# Altium schematic sheet Eload Gen 3 Power Module - Input.SchDoc
size B
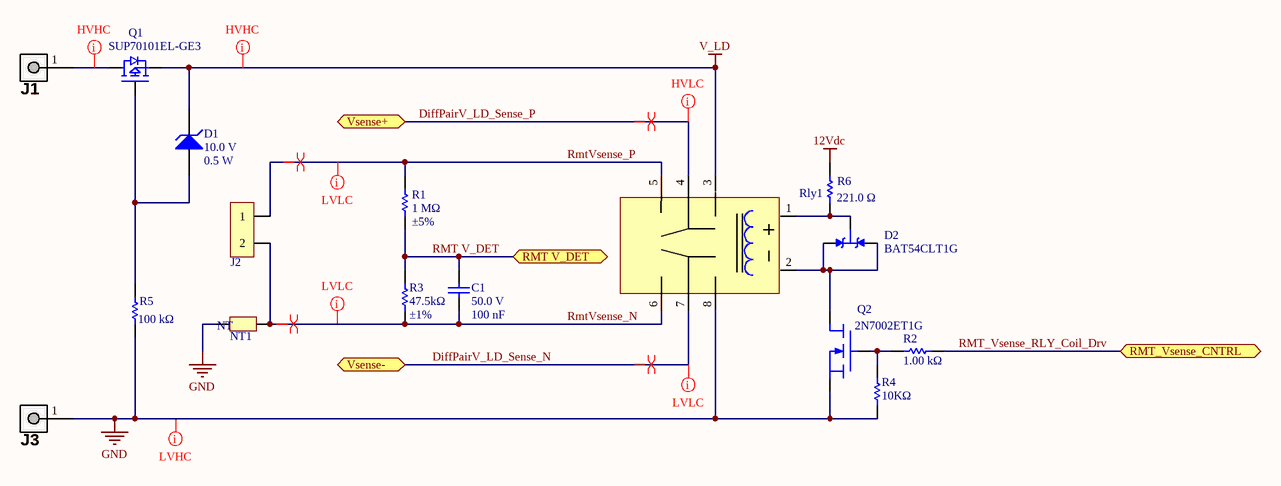
[diagram p0: Eload Gen 3 Power Module - Input.SchDoc]

## Parts
C1  Voltage Rating (DC): 50.0 V  Capacitance: 100 nF  [Cap,0805]  (hidden comment: 08055C104JAT2A)
D1  Breakdown Voltage: 10.0 V  Power Rating: 0.5 W  [SOD123]  (hidden comment: MMSZ5240BT1G)
D2  BAT54CLT1G  [SOT23-3]
J1  wire teminal, lugs, screw, Keystone 8197  [Keystone 8197]  (value not drawn)
J2  TE Connectivity 282836-2  [TERM BLOCK 2POS SIDE ENTRY 5MM]  (value not drawn)
J3  wire teminal, lugs, screw, Keystone 8197  [Keystone 8197]  (value not drawn)
NT1  Net Tie,0.254mm  [0.254mm Net Tie]  (value not drawn)  (net tie, no BOM)
Q1  SUP70101EL-GE3  [TO-220 RA]
Q2  2N7002ET1G  [SOT23-3]
R1  Tolerance: ±5%  Resistance: 1 MΩ  [res, 0805, HD]  (hidden comment: CR0805-JW-105ELF)
R2  Resistance: 1.00 kΩ  [res, 0805, HD]  (hidden comment: Vishay CRCW08051K00JNEA)
R3  Resistance: 47.5kΩ  Tolerance: ±1%  [res, 0805, HD]  (hidden comment: RK73H2ATTD4752F)
R4  Resistance: 10KΩ  [res, 0805, HD]  (hidden comment: Vishay / Dale CRCW080510K0FKTA)
R5  Resistance: 100 kΩ  [res, 0805, HD]  (hidden comment: CRCW0805100KFKEA)
R6  Resistance: 221.0 Ω  [res, 0805, HD]  (hidden comment: Vishay Dale CRCW0805221RFKTA)
Rly1  EE2-5NU  [Relay,SMD,Gull Wing,DPDT (2 Form C),EE2-5NU]  (value not drawn)

## Ports
RMT V_DET, RMT_Vsense_CNTRL, Vsense+, Vsense-

## Nets
12Vdc: R6.2
GND: J3.1 NT1.1 Q2.2(S) R4.1 R5.1 Rly1.8
V_LD: D1.1(K) Q1.3(Source) Rly1.3
DiffPairV_LD_Sense_N: Rly1.7 ; port Vsense-
DiffPairV_LD_Sense_P: Rly1.4 ; port Vsense+
RMT V_DET: C1.2 R1.1 R3.2 ; port RMT V_DET
RMT_Vsense_RLY_Coil_Drv: R2.2 ; port RMT_Vsense_CNTRL
RmtVsense_N: C1.1 J2.2 NT1.2 R3.1 Rly1.6
RmtVsense_P: J2.1 R1.2 Rly1.5
NetD1_2: D1.2(A) Q1.1(Gate) R5.2
NetD2_1: D2.1(A1) D2.2(A2) Q2.3(D) Rly1.2(C-)
NetD2_3: D2.3(C) R6.1 Rly1.1(C+)
NetJ1_1: J1.1 Q1.2(Drain)
NetQ2_1: Q2.1(G) R2.1 R4.2

## Layout directives
differential pair: DiffPairV_LD_Sense_N, DiffPairV_LD_Sense_P, RmtVsense_N, RmtVsense_P
net class Low Volt; net class Low Current; net class PwrRail: DiffPairV_LD_Sense_N, RmtVsense_N, RmtVsense_P
net class High Volt; net class Low Current: DiffPairV_LD_Sense_P
net class High Volt; net class High Current: NetJ1_1, V_LD
net class Low Volt; net class High Current: GND

## Notes on the sheet
- (in symbol Net Tie,0.254mm) NT

## Library data of the parts
C1 = Cap,0805,100nf,50V,5%,08055C104JAT2A: Capacitor; Ceramic; Cap 0.1 uF; Tol 5%; Vol-Rtg 50 VDC; SMT; 0805; X7R; Tape & Reel; Lead-Free Status: Lead Free; Case/Package (SI): 2012; Insulation Resistance: 100 GΩ; Detailed Description: 0.1µF ±5% 50V Ceramic Capacitor X7R 0805 (2012 Metric); Mounting Style: Surface Mount; Packaging: Tape & Reel (TR), Cut Tape (CT); RoHS: Compliant; Size-Width: 1.24 mm; Case/Package: 0805; Number of Pins: 2; digikey url: http://www.digikey.ca/product-detail/en/avx-corporation/08055C104JAT2A/478-3352-1-ND/930144; REACH SVHC Compliance: No SVHC; Dielectric Characteristic: X7R; Capacitance Tolerance: ±5%; Size-Length: 2.01 mm; Size-Height: 710 µm; Size-Thickness: 940 µm; Manufacturer Part Number: 08055C104JAT2A; Octopart URL: http://octopart.com/08055c104jat2a-avx-55388010; Operating Temperature: -55°C ~ 125°C; Supplier 1: Digi-Key; Supplier Part Number 1: 478-3352-1-ND
D1 = Diode, Zener,SOD-123,10V,500mW, MMSZ5240BT1G: Zener Voltage Regulator, 500 mW, 2-Pin SOD-123, Pb-Free, Tape and Reel; Lead-Free Status: Lead Free; Material: Plastic; Case/Package: SOD-123; Lifecycle Status: Active; Mounting Style: Surface Mount; Number of Pins: 2; REACH SVHC Compliance: No SVHC; RoHS: Compliant; Voltage Rating (DC): 10.0 V; Supplier 1: Digi-Key; Supplier Part Number 1: MMSZ5240BT1GOSCT-ND; Supplier 2: LCSC; Supplier Part Number 2: C82084
D2 = Diode, SOT-23-3,600ma,30V,Dual Common Cathode, BAT54CLT1G: BAT54CLT1G Series 30V 600 mA Dual Common Cathode Schottky Barrier Diode-SOT-23-3; Lead-Free Status: Lead Free; Current Rating: 200 mA; Voltage Rating (DC): 30.0 V; Capacitance: 10.0 pF; Lifecycle Status: Active; RoHS: Compliant; Halogen Free Status: Halogen Free; Number of Pins: 3; Mounting Style: Surface Mount; Case/Package: SOT-23; Packaging: Tape & Reel (TR), Cut Tape (CT); REACH SVHC Compliance: No SVHC; Supplier 1: Digi-Key; Supplier Part Number 1: BAT54CLT1GOSCT-ND; Supplier 2: LCSC; Supplier Part Number 2: C14308; mfg P/N: BAT54CLT1G
J1 J3 = wire teminal, lugs, screw, Keystone 8197: WRIGHT TOOL 8197 Socket, 1 In Dr, 3-1/8 In, 12 Pt, Std. More details: Socket, Drive Size 1 In., Number of Points 12, ...; Manufacturer Part Number: 8197; Current Rating: 30.0 A; Pin Pitch: 0.0020066 m; Lead-Free Status: Lead Free; Number of Contacts: 6; Gender: Male; REACH SVHC Compliance: No SVHC; Orientation: Straight; Contact Material: Brass; Size-Height: 0.011684 m; Contact Plating: Tin; Number of Rows: 2; RoHS: Compliant; Mounting Style: Snap-In, PCB; Termination Style: Screw; Supplier 1: Digi-Key; Supplier Part Number 1: 36-8197-ND; Supplier 2: Digi-Key; Supplier Part Number 2: 36-8197-2-ND; Supplier 3: Digi-Key; Supplier Part Number 3: 36-8197-3-ND; Supplier 4: LCSC; Supplier Part Number 4: C238177
J2 = TERM BLOCK 2POS SIDE ENTRY 5MM, 282836-2: Wire to Board 2 Position 5 mm Pitch 30-16 AWG Euro Style Terminal Block; Voltage Rating (AC): 250.0 V; ELV Compliant: Compliant; Current Rating: 13.5 A; Number of Contacts: 2; Pin Pitch: 0.005 m; Lead-Free Status: Lead Free; Wire Gauge: 15.0 AWG; RoHS: Compliant; Contact Material: Brass; Contact Plating: Tin; Color: Green; Manufacturer Part Number: 282836-2; Flammability Rating: UL 94 V-0; Mounting Style: PCB; Housing Material: Nylon 6/6; Insulation Material: Nylon; Housing Color: Green; Orientation: Right Angle; Lifecycle Status: Active; REACH SVHC Compliance: No SVHC; Number of Positions: 2; Supplier 1: TME; Supplier 2: Newark; Supplier 3: Digi-Key; Supplier 4: Digi-Key; Supplier Part Number 4: A98076-ND
Q1 = MOSFET,P-Chan,100V,120A,TO220, SUP70101EL-GE3: MOSFET P-CH 100V 120A TO220AB; Manufacturer: Vishay Siliconix; mfg P/N: SQM50P08-25L_GE3; Detailed Description: P-Channel 100V 120A (Tc) 375W (Tc) Through Hole TO-220AB; Categories: Discrete Semiconductor Products; Current - Continuous Drain (Id) @ 25°C: 120A (Tc); Drive Voltage (Max Rds On, Min Rds On): 4.5V, 10V; Rds On (Max) @ Id, Vgs: 10mOhm; Gate Charge (Qg) (Max) @ Vgs: 190nC @ 10V; Vgs (Max): ±20V; Input Capacitance: 7000pF @ 50V; Power Dissipation (Max): 375W (Tc); Vgs(th) (Max) @ Id: 2.5V @ 250µA; FET Type: P-Channel; Series: Automotive, AEC-Q101, TrenchFET®; Part Status: Active; Technology: MOSFET (Metal Oxide); Drain to Source Voltage (Vdss): 100V; Operating Temperature: -55°C ~ 175°C (TJ); Mounting Type: Through Hole; Supplier Device Package: TO-220AB; Package / Case: TO-220-3; Supplier 1: Digi-Key; Supplier Part Number 1: SUP70101EL-GE3-ND
Q2 = MOSFET,N-Channel,SOT23,0.25A,60V,2N7002ET1G: Small Signal MOSFET, 60 V, 310 mA, Single, N-Channel, 3-Pin SOT-23, Pb-Free, Tape and Reel; Manufacturer: ON Semiconductor; Continuous Drain Current (Ids): 0.25A; Lead-Free Status: Lead Free; Drain to Source Voltage (Vds): 60.0 V; Power Dissipation (Max): 350mW (Ta); REACH SVHC Compliance: No SVHC; Number of Pins: 3; Halogen Free Status: Halogen Free; Case/Package: SOT-23-3; Polarity: N-Channel; RoHS: Compliant; Lifecycle Status: Active; Manufacturer Part Number: 2N7002ET1G; Supplier 1: Digi-Key; Supplier Part Number 1: 2N7002ET1GOSCT-ND; Supplier 2: LCSC; Supplier Part Number 2: C71533
R1 = Res,0805,1MegΩ,5%,200ppm,0805W8F1005T5E: RES SMD 1M OHM 5% 1/8W 0805; Manufacturer: Bourns Inc.; Detailed Description: 1 MOhms ±5% 0.125W, 1/8W Chip Resistor 0805 (2012 Metric) Moisture Resistant Thick Film; Power (Watts): 0.125W, 1/8W; Temperature Coefficient: ±200ppm/°C; mfg P/N: CR0805-JW-105ELF; Category: Resistors  Chip Resistor - Surface Mount; Series: CR0805; Part Status: Active; Composition: Thick Film; Features: Moisture Resistant; Operating Temperature: -55°C ~ 155°C; Package / Case: 0805 (2012 Metric); Supplier Device Package: 0805; Size / Dimension: 0.079"" L x 0.049"" W (2.00mm x 1.25mm); Height - Seated (Max): 0.024"" (0.60mm); Supplier 1: Digi-Key; Supplier Part Number 1: CR0805-JW-105ELFCT-ND; JLC ALt LCSC Part #: C26108
R2 = Res,0805,1.00 kΩ,5%,200ppm,CRCW08051K00JNEA: Res Thick Film 0805 1K Ohm 5% 0.125W(1/8W) ±200ppm/C Molded SMD Automotive Paper T/R; Power Rating: 125 mW; Case/Package (SI): 2012; Lead-Free Status: Lead Free; Temperature Coefficient: 200 ppm/°C; Voltage Rating (DC): 150 V; Size-Width: 1.25 mm; Mounting Style: Surface Mount; REACH SVHC Compliance: No SVHC; Manufacturer Part Number: CRCW08051K00JNEA; Number of Pins: 2; Size-Height: 450 µm; Packaging: Tape & Reel (TR), Cut Tape (CT); RoHS: Compliant; Resistance Tolerance: ±5%; Case/Package: 0805; Size-Length: 2.00 mm; Supplier 1: Digi-Key; Supplier Part Number 1: 541-1.0KADKR-ND; Supplier 2: Digi-Key; Supplier Part Number 2: 541-1.0KACT-ND
R3 = Res,0805,47.5KΩ,1%,100ppm,RK73H2ATTD4752F: 47.5 kOhms ±1% 0.25W, 1/4W Chip Resistor 0805 (2012 Metric) Automotive AEC-Q200, Moisture Resistant Thick Film; Manufacturer: KOA Speer Electronics, Inc.; Temperature Coefficient: ±100ppm/°C; Detailed Description: 47.5 kOhms ±1% 0.25W, 1/4W Chip Resistor 0805 (2012 Metric) Automotive AEC-Q200, Moisture Resistant Thick Film; mfg P/N: RK73H2ATTD4752F; Power (Watts): 0.25W, 1/4W; Composition: Thick Film; Features: Automotive AEC-Q200, Moisture Resistant; Operating Temperature: -55°C ~ 155°C; Package / Case 0805: (2012 Metric); Supplier Device Package: 0805; Size / Dimension: 0.079" L x 0.049" W (2.00mm x 1.25mm); Height - Seated (Max): 0.024" (0.60mm); Number of Terminations: 2; Supplier 1: Digi-Key; Supplier Part Number 1: 2019-RK73H2ATTD4752FCT-ND
R4 = Res,0805,10.0kΩ,1%,100 ppm,CRCW080510K0FKTA: RES SMD 10K OHM 1% 1/8W 0805; Temperature Coefficient: 100.0 ppm/C; Lead-Free Status: Contains Lead; Voltage Rating (DC): 150.0 V; Power Rating: 0.125 W; Case/Package (SI): 2012; Size-Width: 0.00125 m; Resistance Tolerance: 1%; Size-Length: 0.002 m; RoHS: Non-Compliant; Power Dissipation: 0.125 W; Number of Pins: 2; REACH SVHC Compliance: No SVHC; Size-Height: 0.00045 m; Case/Package: 0805; Mounting Style: Surface Mount; Supplier 1: Digi-Key; Supplier Part Number 1: 541-3016-1-ND
R5 = Res,0805,100kΩ,1%,100ppm,CRCW0805100KFKEA: 100 kOhms ±1% 0.125W, 1/8W Chip Resistor 0805 (2012 Metric) Thick Film; Manufacturer: Vishay; Lead-Free Status: Lead Free; Case/Package (SI): 2012; Power Rating: 125 mW; Temperature Coefficient: -100 ppm/°C to 100 ppm/°C; Resistance Tolerance: ±1%; RoHS: Compliant; Manufacturer Part Number: CRCW0805100KFKEA; Number of Pins: 2; Size-Length: 2.00 mm; Packaging: Tape & Reel (TR), Reel, Cut Tape (CT); Size-Height: 450 µm; Case/Package: 0805; Size-Width: 1.25 mm; Operating Temperature: 150 °C (max); Supplier 1 Part Number: 679-0803; Supplier 1: RS; Supplier 2: Digi-Key; Supplier Part Number 2: 541-100KCCT-ND
R6 = Res,0805,221Ω,1%,100ppm,CRCW0805221RFKTA: RES SMD 221 OHM 1% 1/8W 0805; Case/Package (SI): 2012; Lead-Free Status: Contains Lead; Power Dissipation: 0.125 W; Temperature Coefficient: 100.0 ppm/°C; Voltage Rating (DC): 150.0 V; Case/Package: 0805; Mounting Style: Surface Mount; Number of Pins: 2; Power Rating: 0.125 W; Resistance Tolerance: ±1%; RoHS: Non-Compliant; Size-Height: 0.00045 m; Size-Length: 0.002 m; Size-Width: 0.00125 m; Supplier 1: Digi-Key; Supplier Part Number 1: 541-221CCT-ND
Rly1 = Relay,DPDT,2A,250VAC, 220VDC,5Vdc,EE2-5NU: RELAY GEN PURPOSE DPDT 2A 5VDC; Manufacturer: KEMET; Contact Form: DPDT (2 Form C); Switching Voltage: 250VAC, 220VDC - Max; Coil Current: 28.0mA; Coil Type: Non Latching; Must Operate Voltage: 3.75 VDC; Must Release Voltage: 0.5 VDC; Operate Time: 2ms; Release Time: 1ms; Relay Type: General Purpose; Coil Resistance: 178 Ohms; mfg p/n: EE2-5NU; Mounting Type: Surface Mount; Coil Voltage: 5VDC; Contact Rating (Current): 2A; Termination Style: Gull Wing; Operating Temperature: -40°C ~ 85°C; Contact Material: Silver Alloy, Gold Alloy; Supplier 1: Digi-Key; Supplier Part Number 1: 399-11056-5-ND